# Altium schematic sheet Bandpass Filter.schdoc: Bandpass Filter
size A4; Organization: Altium Limited; Address1: L3, 12a Rodborough Rd; Address2: Frenchs Forest; Address3: NSW; Address4: Australia 2086; DocumentNumber: 1; SheetNumber: 1; SheetTotal: 1
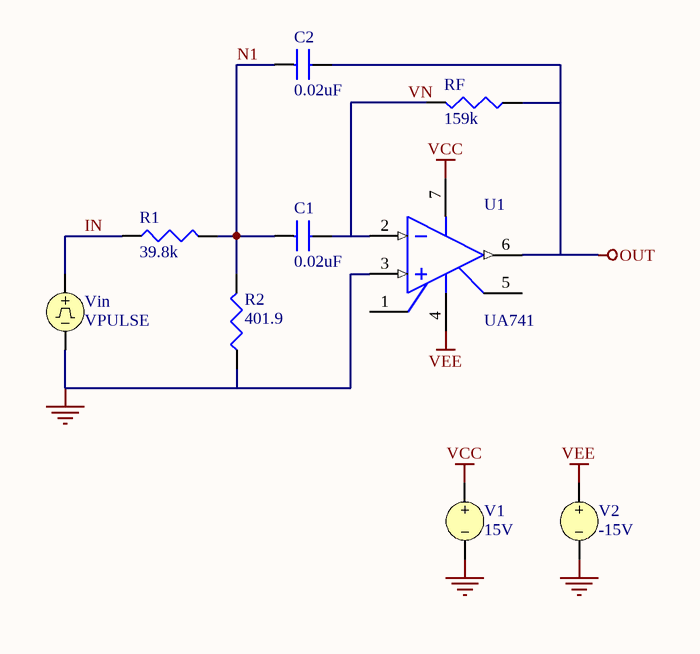
[diagram p0: Bandpass Filter.schdoc]

## Parts
C1  0.02uF
C2  0.02uF
R1  39.8k
R2  401.9
RF  159k
U1  UA741
V1  15V
V2  -15V
Vin  VPULSE

## Nets
GND: R2.2(BOT) U1.3(+IN) V1.2 V2.2 Vin.2
OUT: C2.2 RF.2(BOT) U1.6(OUT)
VCC: U1.7(V+) V1.1
VEE: U1.4(V-) V2.1
IN: R1.2(BOT) Vin.1
N1: C1.1 C2.1 R1.1(TOP) R2.1(TOP)
VN: C1.2 RF.1(TOP) U1.2(-IN)

Not connected (* = marked no-connect by the designer): U1 1(OFFSET_NULL_1) 5(OFFSET_NULL_2)

## Notes on the sheet
- Title
- Size:
- Date:
- A4
- Number:
- Time:
- Revision:
- Sheet
- of
- File:

## Library data of the parts
C1 C2 = CAP: Capacitor; Value: 0.02uF
R1 R2 RF = RES: Resistor
  R1: Value: 39.8k
  R2: Value: 401.9
  RF: Value: 159k
U1 = UA741: General-Purpose Operational Amplifier
V1 V2 = VSRC: Voltage Source
  V1: Value: 15V
  V2: Value: -15V
Vin = VPULSE: Pulse Voltage Source